# EAGLE design IA-prop-raspberry (EAGLE 6.1)
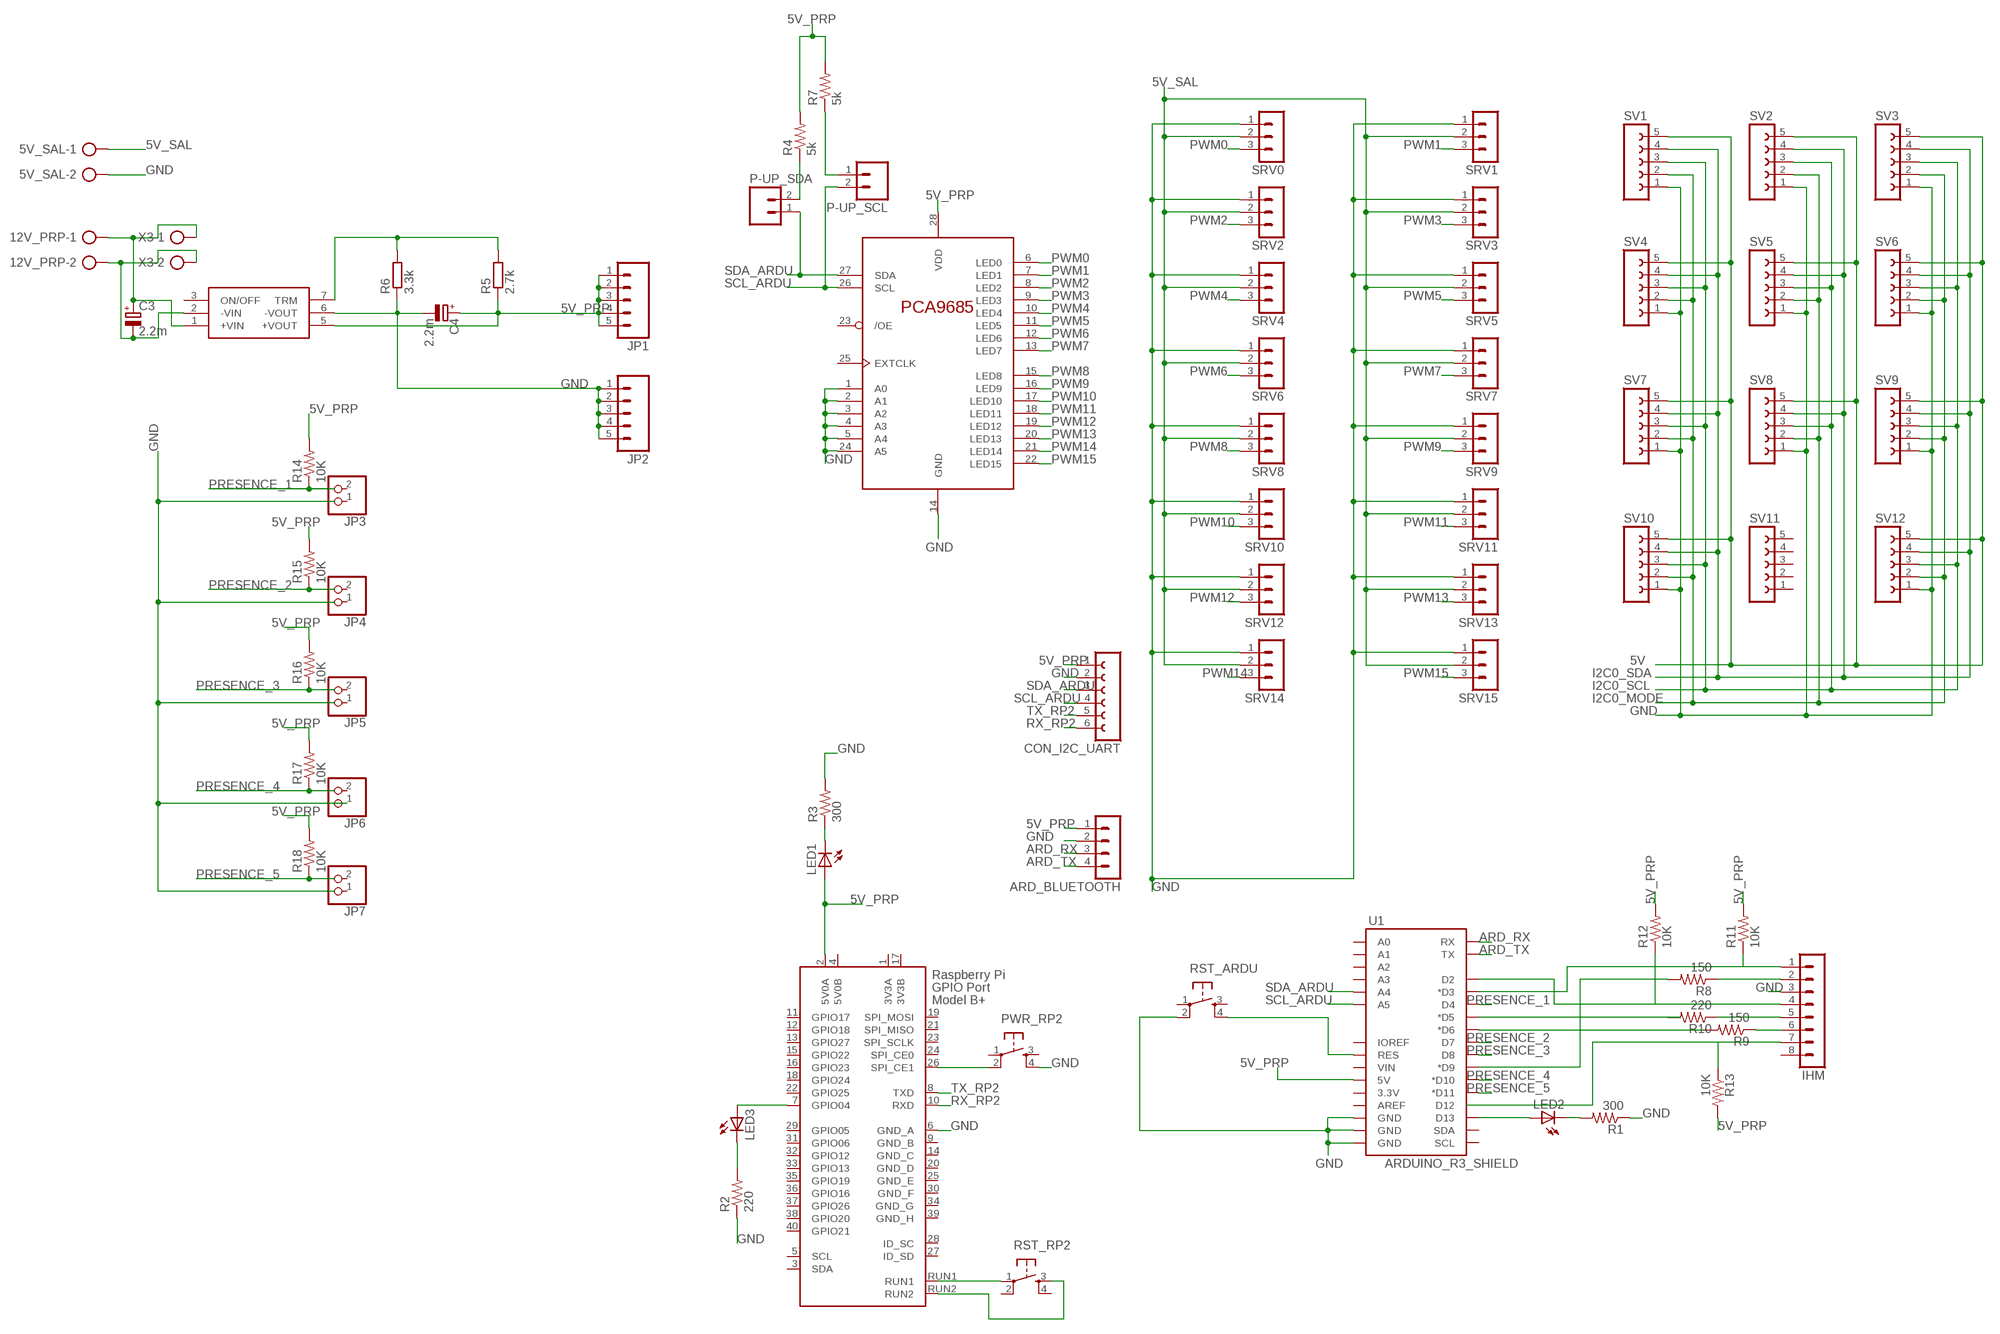
[diagram p0: schematic, sheet 1]

## Parts
5V_SAL  AK300/2  [AK300/2]
12V_PRP  AK300/2  [AK300/2]
ARD_BLUETOOTH  MA04-1  [MA04-1]
C3  2.2m  CPOL-EUE5-13  [E5-13]
C4  2.2m  CPOL-EUE5-13  [E5-13]
CON_I2C_UART  FE06-1  [FE06]
IHM  MA08-1  [MA08-1]
JP1  M05PTH  [1X05]
JP2  M05PTH  [1X05]
JP3  PINHD-1X2  [1X02]
JP4  PINHD-1X2  [1X02]
JP5  PINHD-1X2  [1X02]
JP6  PINHD-1X2  [1X02]
JP7  PINHD-1X2  [1X02]
LED1  LED3MM  [LED3MM]
LED2  LED3MM  [LED3MM]
LED3  LED3MM  [LED3MM]
P-UP_SCL  M02PTH  [1X02]
P-UP_SDA  M02PTH  [1X02]
PWR_RP2  TAC_SWITCHPTH  [TACTILE-PTH]
R1  300  RESISTORAXIAL-0.3  [AXIAL-0.3]
R2  220  RESISTORAXIAL-0.3  [AXIAL-0.3]
R3  300  RESISTORAXIAL-0.3  [AXIAL-0.3]
R4  5k  RESISTORAXIAL-0.3  [AXIAL-0.3]
R5  2.7k  R-EU_0207/7  [0207/7]
R6  3.3k  R-EU_0207/7  [0207/7]
R7  5k  RESISTORAXIAL-0.3  [AXIAL-0.3]
R8  150  RESISTORAXIAL-0.3  [AXIAL-0.3]
R9  150  RESISTORAXIAL-0.3  [AXIAL-0.3]
R10  220  RESISTORAXIAL-0.3  [AXIAL-0.3]
R11  10K  RESISTORAXIAL-0.3  [AXIAL-0.3]
R12  10K  RESISTORAXIAL-0.3  [AXIAL-0.3]
R13  10K  RESISTORAXIAL-0.3  [AXIAL-0.3]
R14  10K  RESISTORAXIAL-0.3  [AXIAL-0.3]
R15  10K  RESISTORAXIAL-0.3  [AXIAL-0.3]
R16  10K  RESISTORAXIAL-0.3  [AXIAL-0.3]
R17  10K  RESISTORAXIAL-0.3  [AXIAL-0.3]
R18  10K  RESISTORAXIAL-0.3  [AXIAL-0.3]
RP2  RASPI_BOARD_B+#_FP  [RASPI_BOARD_B+_FULL_PAD]
RST_ARDU  TAC_SWITCHPTH  [TACTILE-PTH]
RST_RP2  TAC_SWITCHPTH  [TACTILE-PTH]
SRV0  MA03-1  [MA03-1]
SRV1  MA03-1  [MA03-1]
SRV2  MA03-1  [MA03-1]
SRV3  MA03-1  [MA03-1]
SRV4  MA03-1  [MA03-1]
SRV5  MA03-1  [MA03-1]
SRV6  MA03-1  [MA03-1]
SRV7  MA03-1  [MA03-1]
SRV8  MA03-1  [MA03-1]
SRV9  MA03-1  [MA03-1]
SRV10  MA03-1  [MA03-1]
SRV11  MA03-1  [MA03-1]
SRV12  MA03-1  [MA03-1]
SRV13  MA03-1  [MA03-1]
SRV14  MA03-1  [MA03-1]
SRV15  MA03-1  [MA03-1]
SV1  FE05-1  [FE05-1]
SV2  FE05-1  [FE05-1]
SV3  FE05-1  [FE05-1]
SV4  FE05-1  [FE05-1]
SV5  FE05-1  [FE05-1]
SV6  FE05-1  [FE05-1]
SV7  FE05-1  [FE05-1]
SV8  FE05-1  [FE05-1]
SV9  FE05-1  [FE05-1]
SV10  FE05-1  [FE05-1]
SV11  FE05-1  [FE05-1]
SV12  FE05-1  [FE05-1]
U1  ARDUINO_R3_SHIELD  [UNO_R3_SHIELD]
U$1  PCA9685PW  [TSSOP28]
U$2  TEN25-1211TEN25-1211  [TEN25]
X3  AK300/2  [AK300/2]

## Nets
5V: SV1.5 SV2.5 SV3.5 SV4.5 SV5.5 SV6.5 SV7.5 SV8.5 SV9.5 SV10.5 SV12.5
5V_PRP: ARD_BLUETOOTH.1 C4.+ CON_I2C_UART.1 JP1.1 JP1.2 JP1.3 JP1.4 JP1.5 LED1.A R4.P$2 R5.1 R7.P$2 R11.P$2 R12.P$2 R13.P$2 R14.P$2 R15.P$2 R16.P$2 R17.P$2 R18.P$2 RP2.2(5V0A) U1.5V U$1.28(VDD) U$2.5(+VOUT)
5V_PRP1: LED2.A U1.D13
5V_SAL: 5V_SAL.1 SRV0.2 SRV1.2 SRV2.2 SRV3.2 SRV4.2 SRV5.2 SRV6.2 SRV7.2 SRV8.2 SRV9.2 SRV10.2 SRV11.2 SRV12.2 SRV13.2 SRV14.2 SRV15.2
+12V: 12V_PRP.1 C3.+ U$2.1(+VIN) X3.1
ARD_RX: ARD_BLUETOOTH.3 U1.RX
ARD_TX: ARD_BLUETOOTH.4 U1.TX
GND: 5V_SAL.2 ARD_BLUETOOTH.2 C4.- CON_I2C_UART.2 IHM.3 JP2.1 JP2.2 JP2.3 JP2.4 JP2.5 JP6.1 PWR_RP2.4 R1.P$1 R2.P$1 R3.P$2 R6.1 RP2.6(GND_A) RST_ARDU.2 SRV0.1 SRV1.1 SRV2.1 SRV3.1 SRV4.1 SRV5.1 SRV6.1 SRV7.1 SRV8.1 SRV9.1 SRV10.1 SRV11.1 SRV12.1 SRV13.1 SRV14.1 SRV15.1 SV1.1 SV2.1 SV3.1 SV4.1 SV5.1 SV6.1 SV7.1 SV8.1 SV9.1 SV10.1 SV12.1 U1.GND@0(GND) U1.GND@1(GND) U1.GND@2(GND) U$1.1(A0) U$1.2(A1) U$1.3(A2) U$1.4(A3) U$1.5(A4) U$1.14(GND) U$1.24(A5) U$2.6(-VOUT)
GND_12: 12V_PRP.2 C3.- U$2.2(-VIN) X3.2
I2C0_MODE: SV1.2 SV2.2 SV3.2 SV4.2 SV5.2 SV6.2 SV7.2 SV8.2 SV9.2 SV10.2 SV12.2
I2C0_SCL: SV1.3 SV2.3 SV3.3 SV4.3 SV5.3 SV6.3 SV7.3 SV8.3 SV9.3 SV10.3 SV12.3
I2C0_SDA: SV1.4 SV2.4 SV3.4 SV4.4 SV5.4 SV6.4 SV7.4 SV8.4 SV9.4 SV10.4 SV12.4
N$1: RP2.RUN2 RST_RP2.3
N$2: LED2.K(C) R1.P$2
N$3: LED3.K(C) R2.P$2
N$4: R5.2 R6.2 U$2.7(TRM)
N$5: P-UP_SDA.2 R4.P$1
N$7: LED1.K(C) R3.P$1
N$8: RST_ARDU.4 U1.RES
N$9: P-UP_SCL.1 R7.P$1
N$39: U1.D5(*D5)
N$40: R9.P$2 U1.D6(*D6)
N$41: IHM.6 R9.P$1
N$42: LED3.A RP2.7(GPIO04)
N$43: IHM.5 R10.P$1
N$44: IHM.2 R8.P$1
N$45: R8.P$2 U1.D9(*D9)
N$46: IHM.1 R11.P$1 U1.D3(*D3)
N$47: IHM.4 R12.P$1 U1.D2
N$48: RP2.RUN1 RST_RP2.1
N$49: IHM.7 R13.P$1
PRESENCE_1: R14.P$1 U1.D4
PRESENCE_2: R15.P$1 U1.D7
PRESENCE_3: R16.P$1 U1.D8
PRESENCE_4: R17.P$1 U1.D10(*D10)
PRESENCE_5: R18.P$1 U1.D11(*D11)
PWM0: SRV0.3 U$1.6(LED0)
PWM1: SRV1.3 U$1.7(LED1)
PWM2: SRV2.3 U$1.8(LED2)
PWM3: SRV3.3 U$1.9(LED3)
PWM4: SRV4.3 U$1.10(LED4)
PWM5: SRV5.3 U$1.11(LED5)
PWM6: SRV6.3 U$1.12(LED6)
PWM7: SRV7.3 U$1.13(LED7)
PWM8: SRV8.3 U$1.15(LED8)
PWM9: SRV9.3 U$1.16(LED9)
PWM10: SRV10.3 U$1.17(LED10)
PWM11: SRV11.3 U$1.18(LED11)
PWM12: SRV12.3 U$1.19(LED12)
PWM13: SRV13.3 U$1.20(LED13)
PWM14: SRV14.3 U$1.21(LED14)
PWM15: SRV15.3 U$1.22(LED15)
RP2_PWR: PWR_RP2.2 RP2.26(SPI_CE1)
RX_RP2: CON_I2C_UART.6 RP2.10(RXD)
SCL_ARDU: CON_I2C_UART.4 P-UP_SCL.2 U1.A5 U$1.26(SCL)
SDA_ARDU: CON_I2C_UART.3 P-UP_SDA.1 U1.A4 U$1.27(SDA)
TX_RP2: CON_I2C_UART.5 RP2.8(TXD)
Unconnected: IHM.8 JP3.1 JP3.2 JP4.1 JP4.2 JP5.1 JP5.2 JP6.2 JP7.1 JP7.2 PWR_RP2.1 PWR_RP2.3 R10.P$2 RP2.3(SDA) RP2.5(SCL) RP2.11(GPIO17) RP2.12(GPIO18) RP2.13(GPIO27) RP2.15(GPIO22) RP2.16(GPIO23) RP2.18(GPIO24) RP2.19(SPI_MOSI) RP2.21(SPI_MISO) RP2.22(GPIO25) RP2.23(SPI_SCLK) RP2.24(SPI_CE0) RP2.27(ID_SD) RP2.28(ID_SC) RP2.29(GPIO05) RP2.31(GPIO06) RP2.32(GPIO12) RP2.33(GPIO13) RP2.35(GPIO19) RP2.36(GPIO16) RP2.37(GPIO26) RP2.38(GPIO20) RP2.40(GPIO21) RST_ARDU.1 RST_ARDU.3 RST_RP2.2 RST_RP2.4 SV11.1 SV11.2 SV11.3 SV11.4 SV11.5 U1.3.3V U1.A0 U1.A1 U1.A2 U1.A3 U1.AREF U1.D12 U1.IOREF U1.SCL U1.SDA U1.VIN U$1.23(/OE) U$1.25(EXTCLK) U$2.3(ON/OFF)

## Power pins joined to a net without a drawn wire
3V3A: RP2.1(3V3A)
3V3B: RP2.17(3V3B)
5V0B: RP2.4(5V0B)
GND_B: RP2.9(GND_B)
GND_C: RP2.14(GND_C)
GND_D: RP2.20(GND_D)
GND_E: RP2.25(GND_E)
GND_F: RP2.30(GND_F)
GND_G: RP2.34(GND_G)
GND_H: RP2.39(GND_H)

## Library data of the parts
5V_SAL 12V_PRP X3 = con-ptr500:AK300/2: CONNECTOR; OC_FARNELL: unknown; OC_NEWARK: unknown
ARD_BLUETOOTH = con-lstb:MA04-1: PIN HEADER
C3 C4 = resistor:CPOL-EU: POLARIZED CAPACITOR, European symbol
CON_I2C_UART = con-lsta:FE06-1: FEMALE HEADER; OC_FARNELL: unknown; OC_NEWARK: unknown
IHM = con-lstb:MA08-1: PIN HEADER
JP1 JP2 = SparkFun:M05: Header 5 Standard 5-pin 0.1" header. Use with straight break away headers (SKU : PRT-00116), right angle break away headers (PRT-00553), swiss pins (PRT-00743), machine pins (PRT-00117), and female headers (PRT-00115). Molex polarized connector foot print use with SKU : PRT-08230 with associated crimp pins and housings.
JP3-JP7 = pinhead:PINHD-1X2: PIN HEADER
LED1-LED3 = SparkFun:LED: LEDs Standard schematic elements and footprints for 5mm, 3mm, 1206, and 0603 sized LEDs. 5mm - Spark Fun Electronics SKU : COM-00529 (and others)
P-UP_SCL P-UP_SDA = SparkFun:M02: Header 2 Standard 2-pin 0.1" header. Use with straight break away headers (SKU : PRT-00116), right angle break away headers (PRT-00553), swiss pins (PRT-00743), machine pins (PRT-00117), and female headers (PRT-00115). Molex polarized connector foot print use with SKU : PRT-08233 with associated crimp pins and housings.
PWR_RP2 RST_ARDU RST_RP2 = SparkFun:TAC_SWITCH: Momentary Switch Button commonly used for reset or general input. Spark Fun Electronics SKU : COM-00097
R1-R4 R7-R18 = SparkFun:RESISTOR: Resistor Basic schematic elements and footprints for 0603, 1206, and PTH resistors.
R5 R6 = resistor:R-EU_: RESISTOR, European symbol
RP2 = raspberrypi_bastelstube_v13-enac:RASPI_BOARD_B+#: Raspberry Pi GPIO connector with markings for the outer dimensions of the Raspberry Pi board model B+ with different sets of drill holes or mounting pads All pins connected
SRV0 SRV1-SRV15 = con-lstb:MA03-1: PIN HEADER
SV1-SV12 = con-lsta:FE05-1: FEMALE HEADER; OC_FARNELL: unknown; OC_NEWARK: unknown
U1 = SparkFun-Boards:ARDUINO_R3_SHIELD: Shield form compatible with the Arduino Uno R3.
U$1 = PCA9685:PCA9685
U$2 = tracopower:TEN25-1211

## Board
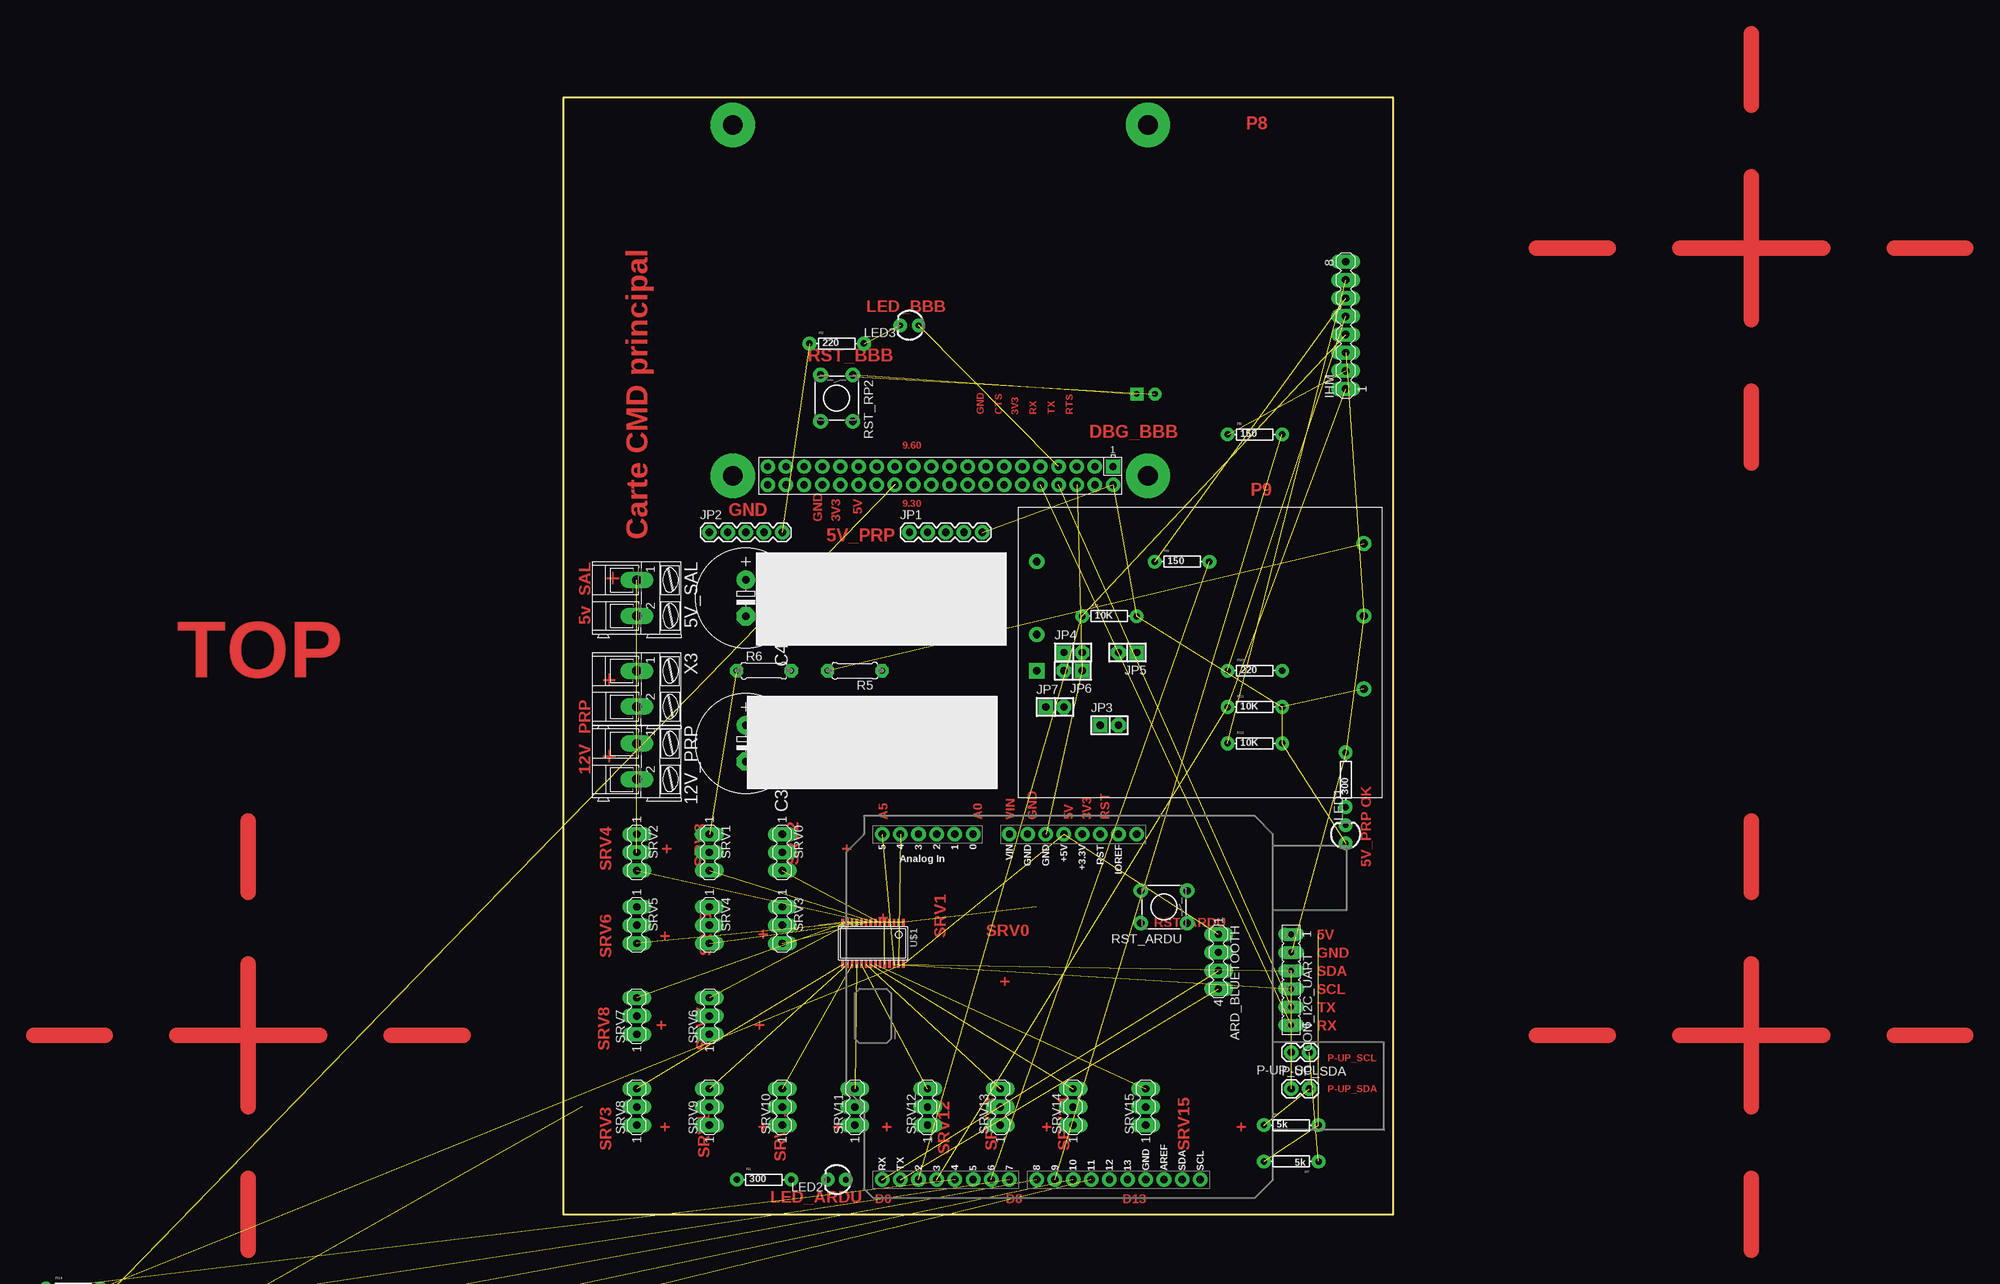
[diagram p1: board, top side]
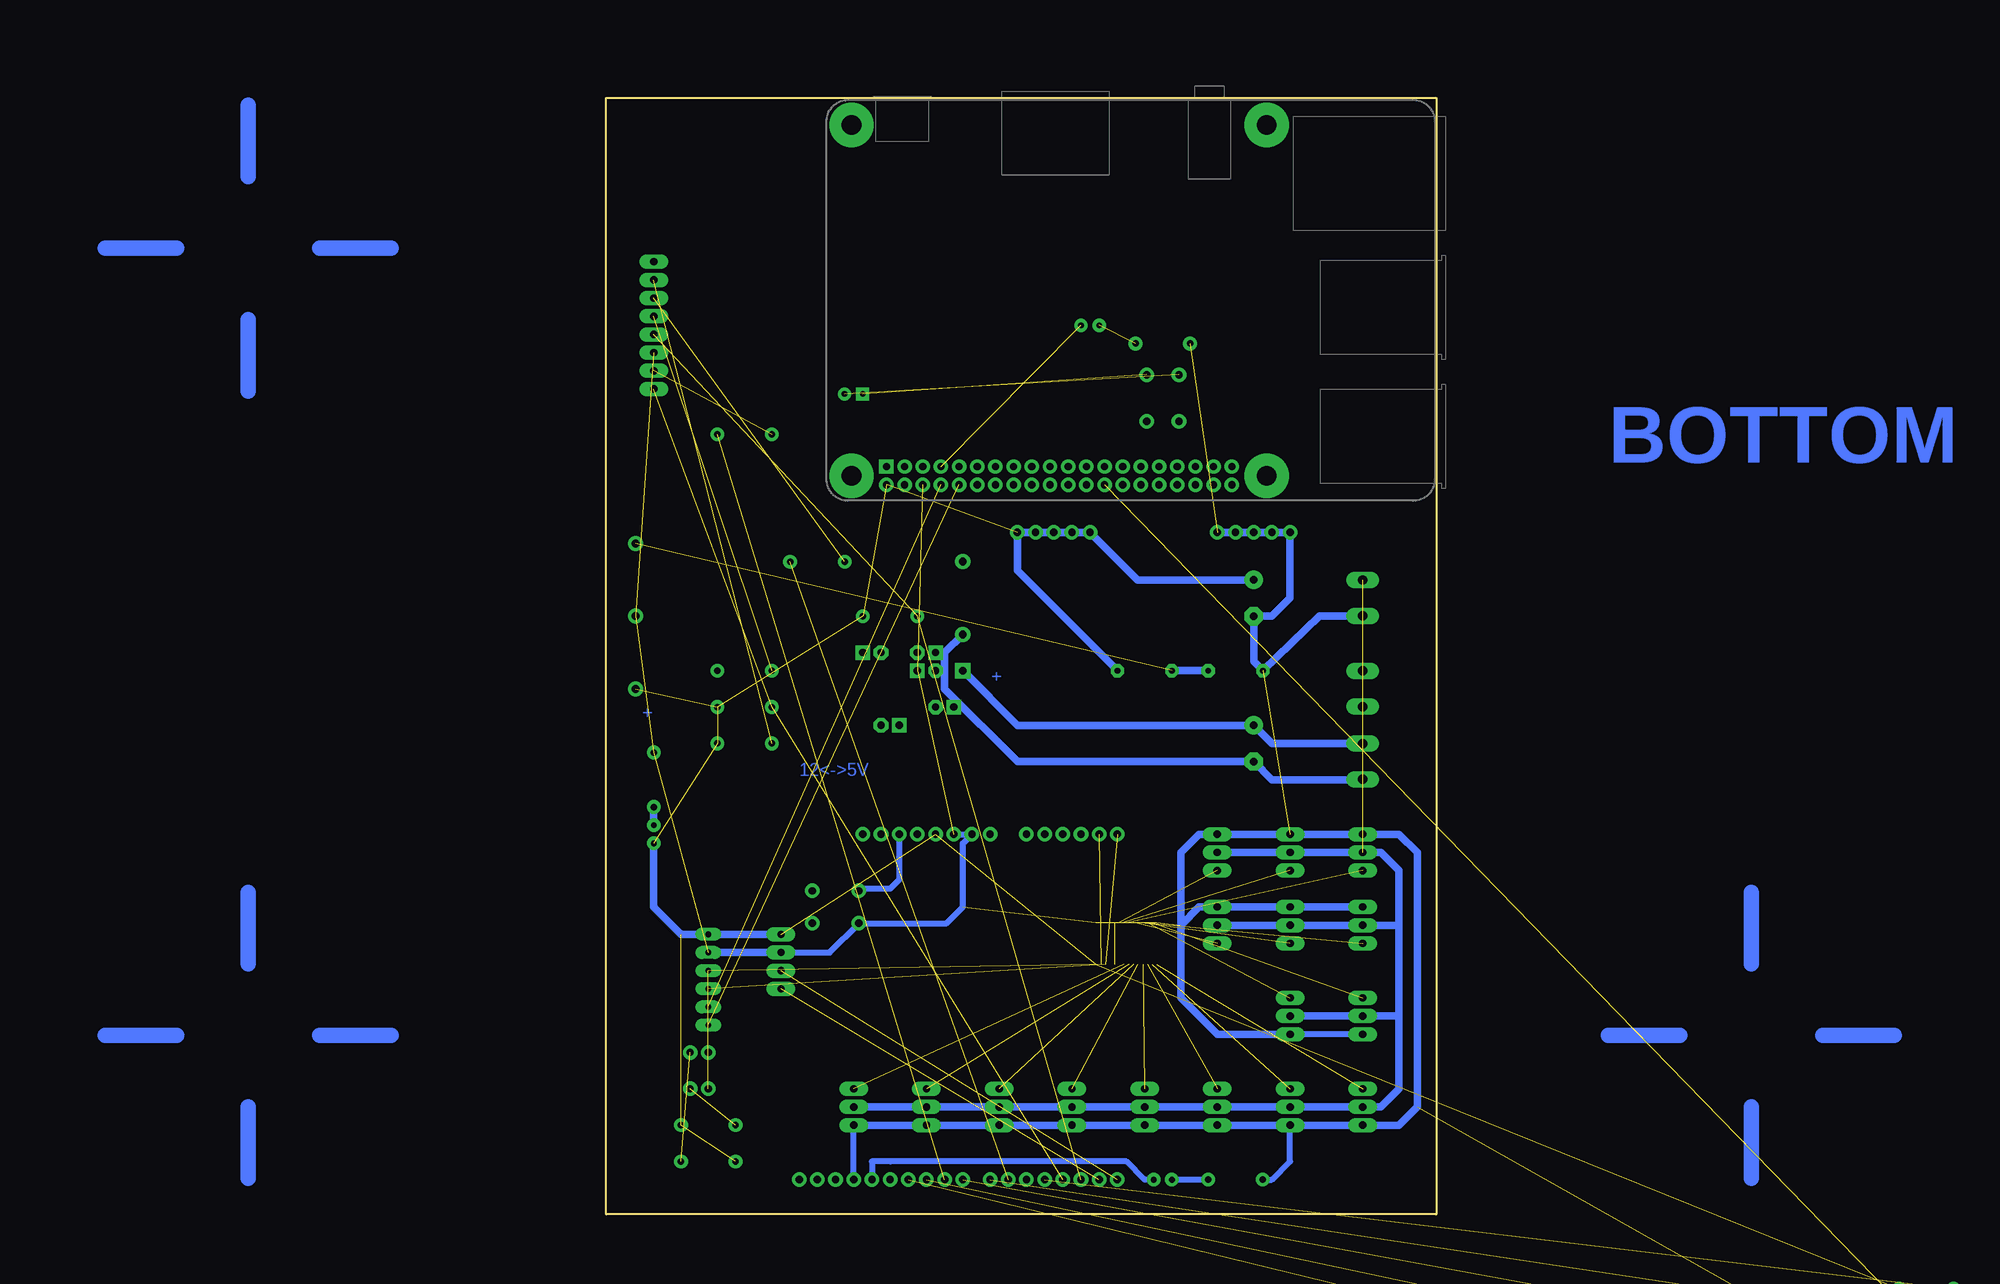
[diagram p2: board, bottom side, seen from below]

Size 116 x 156 mm. Coordinates in mm from the lower left corner, seen from the top.
Outline: 0,0 116,0 116,156 0,156 0,0
Copper layers (1*16): Top 0.035mm / dielectric 1.5mm / Bottom 0.035mm
Design rules: minimum track width 10mil, minimum drill 10mil, track to track 15mil, track to pad 15mil, pad to pad 15mil, via to via 15mil, smd to smd 8mil, copper to edge 40mil, drill to drill 8mil, minimum pad ring 15mil, minimum via ring 8mil, stop-mask expansion 4mil, vias tented up to drill 0mil, thermal gap 10mil

### Footprints (pad centres in the part's own frame; a part is rotated, then mirrored left to right if it is on the bottom)
AK300/2 = drill 1.321 long: 1 -2.515,0; 2 2.489,0
MA04-1 = drill 1.016 long: 1 -3.81,0; 2 -1.27,0; 3 1.27,0; 4 3.81,0
E5-13 = drill 1.016 pad 2.54: + -2.54,0 | drill 1.016 pad 2.54 octagon: - 2.54,0
FE06 = drill 0.813 long: 1 -6.35,0; 2 -3.81,0; 3 -1.27,0; 4 1.27,0; 5 3.81,0; 6 6.35,0
MA08-1 = drill 1.016 long: 1 -8.89,0; 2 -6.35,0; 3 -3.81,0; 4 -1.27,0; 5 1.27,0; 6 3.81,0; 7 6.35,0; 8 8.89,0
1X05 = drill 1.016 pad 1.88: 1 0,0; 2 2.54,0; 3 5.08,0; 4 7.62,0; 5 10.16,0
1X02 = drill 1.016 square: 1 -1.27,0 | drill 1.016 octagon: 2 1.27,0
LED3MM = drill 0.813 pad 1.88: A -1.27,0; K 1.27,0
1X02' = drill 1.016 pad 1.88: 1 0,0; 2 2.54,0
TACTILE-PTH = drill 1.016 pad 1.88: 1 -3.251,2.261; 2 3.251,2.261; 3 -3.251,-2.261; 4 3.251,-2.261
AXIAL-0.3 = drill 0.9 pad 1.88: P$1 -3.81,0; P$2 3.81,0
0207/7 = drill 0.813 octagon: 1 -3.81,0; 2 3.81,0
RASPI_BOARD_B+_FULL_PAD = drill 1 pad 1.778 square: 1 8.37,51.23 | drill 1 pad 1.778: 2 8.37,53.77; 3 10.91,51.23; 4 10.91,53.77; 5 13.45,51.23; 6 13.45,53.77; 7 15.99,51.23; 8 15.99,53.77; 9 18.53,51.23; 10 18.53,53.77; 11 21.07,51.23; 12 21.07,53.77; 13 23.61,51.23; 14 23.61,53.77; 15 26.15,51.23; 16 26.15,53.77; 17 28.69,51.23; 18 28.69,53.77; 19 31.23,51.23; 20 31.23,53.77; 21 33.77,51.23; 22 33.77,53.77; 23 36.31,51.23; 24 36.31,53.77; 25 38.85,51.23; 26 38.85,53.77; 27 41.39,51.23; 28 41.39,53.77; 29 43.93,51.23; 30 43.93,53.77; 31 46.47,51.23; 32 46.47,53.77; 33 49.01,51.23; 34 49.01,53.77; 35 51.55,51.23; 36 51.55,53.77; 37 54.09,51.23; 38 54.09,53.77; 39 56.63,51.23; 40 56.63,53.77 | drill 2.75 pad 6.2: DRILL_1 3.5,52.5; DRILL_2 61.5,52.5; DRILL_3 3.5,3.5; DRILL_4 61.5,3.5 | drill 0.8 square: RUN1 5.068,41.07 | drill 0.8: RUN2 2.528,41.07
MA03-1 = drill 1.016 long: 1 -2.54,0; 2 0,0; 3 2.54,0
FE05-1 = drill 0.813 long: 1 -5.08,0; 2 -2.54,0; 3 0,0; 4 2.54,0; 5 5.08,0
UNO_R3_SHIELD = drill 1.016 pad 1.88: 3.3V 50.8,26.67; 5V 50.8,29.21; A0 50.8,41.91; A1 50.8,44.45; A2 50.8,46.99; A3 50.8,49.53; A4 50.8,52.07; A5 50.8,54.61; AREF 2.54,15.24; D2 2.54,49.53; D3 2.54,46.99; D4 2.54,44.45; D5 2.54,41.91; D6 2.54,39.37; D7 2.54,36.83; D8 2.54,33.02; D9 2.54,30.48; D10 2.54,27.94; D11 2.54,25.4; D12 2.54,22.86; D13 2.54,20.32; GND@0 50.8,31.75; GND@1 50.8,34.29; GND@2 2.54,17.78; IOREF 50.8,21.59; NC 50.8,19.05; RES 50.8,24.13; RX 2.54,54.61; SCL 2.54,10.16; SDA 2.54,12.7; TX 2.54,52.07; VIN 50.8,36.83
TSSOP28 = smd 0.305 x 0.991: 1 -4.225,-2.918; 2 -3.575,-2.918; 3 -2.925,-2.918; 4 -2.275,-2.918; 5 -1.625,-2.918; 6 -0.975,-2.918; 7 -0.325,-2.918; 8 0.325,-2.918; 9 0.975,-2.918; 10 1.625,-2.918; 11 2.275,-2.918; 12 2.925,-2.918; 13 3.575,-2.918; 14 4.225,-2.918; 15 4.225,2.918; 16 3.575,2.918; 17 2.925,2.918; 18 2.275,2.918; 19 1.625,2.918; 20 0.975,2.918; 21 0.325,2.918; 22 -0.325,2.918; 23 -0.975,2.918; 24 -1.625,2.918; 25 -2.275,2.918; 26 -2.925,2.918; 27 -3.575,2.918; 28 -4.225,2.918
TEN25 = drill 1.1 pad 1.778 square: 1 0,0 | drill 1.1 pad 1.778: 2 0,5.08; 3 0,15.24; 5 45.72,-2.54; 6 45.72,7.62; 7 45.72,17.78

### Placement (x,y rotation side)
5V_SAL  10.28,86.12 270 top
12V_PRP  10.28,63.26 270 top
ARD_BLUETOOTH  91.56,35.32 270 top
C3  25.52,65.8 270 top
C4  25.52,86.12 270 top
CON_I2C_UART  101.72,32.78 270 top
IHM  109.34,124.22 90 top
JP1  48.38,95.3 0 top
JP2  20.44,95.3 0 top
JP3  76.32,68.34 0 top
JP4  71.24,78.5 0 top
JP5  78.86,78.5 180 top
JP6  71.24,75.96 180 top
JP7  68.7,70.88 0 top
LED1  109.34,53.1 90 top
LED2  38.22,4.84 180 top
LED3  48.38,124.22 180 top
P-UP_SCL  [1X02']  104.26,22.62 180 top
P-UP_SDA  [1X02']  101.72,17.54 0 top
PWR_RP2  -81.16,-28.18 0 top  (outside the outline)
R1  28.06,4.84 0 top
R2  38.22,121.68 0 top
R3  109.34,60.72 90 top
R4  101.72,12.46 0 top
R5  40.76,75.96 180 top
R6  28.06,75.96 0 top
R7  101.72,7.38 180 top
R8  96.64,108.98 0 top
R9  86.48,91.2 0 top
R10  96.64,75.96 0 top
R11  96.64,70.88 0 top
R12  76.32,83.58 0 top
R13  96.64,65.8 0 top
R14  -68.46,-10.4 0 top  (outside the outline)
R15  -68.46,-15.48 0 top  (outside the outline)
R16  -68.46,-20.56 0 top  (outside the outline)
R17  -68.46,-25.64 0 top  (outside the outline)
R18  -68.46,-30.72 0 top  (outside the outline)
RP2  85.21,155.72 180 top
RST_ARDU  83.94,42.94 180 top
RST_RP2  38.22,114.06 270 top
SRV0  30.6,50.56 270 top
SRV1  20.44,50.56 270 top
SRV2  10.28,50.56 270 top
SRV3  30.6,40.4 270 top
SRV4  20.44,40.4 270 top
SRV5  10.28,40.4 270 top
SRV6  20.44,27.7 90 top
SRV7  10.28,27.7 90 top
SRV8  10.28,15 90 top
SRV9  20.44,15 90 top
SRV10  30.6,15 90 top
SRV11  40.76,15 90 top
SRV12  50.92,15 90 top
SRV13  61.08,15 90 top
SRV14  71.24,15 90 top
SRV15  81.4,15 90 top
SV1  -76.08,-35.8 0 top  (outside the outline)
SV2  -76.08,-43.42 0 top  (outside the outline)
SV3  -76.08,-51.04 0 top  (outside the outline)
SV4  -76.08,-58.66 0 top  (outside the outline)
SV5  -76.08,-66.28 0 top  (outside the outline)
SV6  -76.08,-73.9 0 top  (outside the outline)
SV7  -76.08,-81.52 0 top  (outside the outline)
SV8  -76.08,-89.14 0 top  (outside the outline)
SV9  -76.08,-96.76 0 top  (outside the outline)
SV10  -76.08,-104.38 0 top  (outside the outline)
SV11  -76.08,-112 0 top  (outside the outline)
SV12  -76.08,-119.62 0 top  (outside the outline)
U1  99.18,2.3 90 top
U$1  43.3,37.86 180 top
U$2  66.16,75.96 0 top
X3  10.28,73.42 270 top

### Tracks (layer width: path | path; a pad name or v marks a point on that pad's centre or on a via)
5V  (10 unrouted)
5V_PRP  (15 unrouted)
  Bottom 1.016: ARD_BLUETOOTH.1 CON_I2C_UART.1 105.53,39.13 109.34,42.94 LED1.A | R5.1 58.54,89.93 JP1.5 JP1.4 JP1.3 JP1.2 JP1.1 41.74,88.66 C4.+
5V_PRP1
  Bottom 0.813: LED2.A 40.76,4.84 43.3,7.38 76.32,7.38 78.86,7.38 U1.D13
5V_SAL  (1 unrouted)
  Bottom 1.016: SRV15.2 SRV14.2 SRV13.2 SRV12.2 SRV11.2 SRV10.2 SRV9.2 SRV8.2 7.74,15 5.2,17.54 5.2,27.7 | SRV3.2 SRV4.2 SRV5.2 5.2,40.4 | SRV0.2 SRV1.2 SRV2.2 7.74,50.56 5.2,48.02 5.2,40.4 | SRV6.2 SRV7.2 5.2,27.7 | 5.2,27.7 5.2,40.4
+12V  (2 unrouted)
  Bottom 1.016: U$2.1 58.54,68.34 C3.+ 22.98,65.8 10.28,65.8
ARD_RX  (1 unrouted)
ARD_TX  (1 unrouted)
GND  (27 unrouted)
  Bottom 0.813: R1.P$1 22.98,4.84 20.44,7.38 SRV9.1 | U1.GND@2 SRV15.1 | SRV7.1 SRV6.1 | 33.14,42.94 SRV3.1 | ARD_BLUETOOTH.2 84.78,36.59 RST_ARDU.2 68.42,40.68 66.16,42.94 66.16,51.83 U1.GND@1 U1.GND@0
  Bottom 1.016: SRV15.1 SRV14.1 SRV13.1 SRV12.1 SRV11.1 SRV10.1 SRV9.1 SRV8.1 5.2,12.46 2.66,15 2.66,50.56 5.2,53.1 SRV2.1 SRV1.1 SRV0.1 33.14,53.1 35.68,50.56 35.68,40.4 | SRV6.1 30.6,25.16 35.68,30.24 35.68,40.4 | 35.68,40.4 33.14,42.94 SRV3.1 SRV4.1 SRV5.1 | ARD_BLUETOOTH.2 CON_I2C_UART.2 | 5V_SAL.2 16.33,83.63 R6.1 25.52,77.23 C4.- 22.98,83.58 20.44,86.12 JP2.1 JP2.2 JP2.3 JP2.4 JP2.5
GND_12  (2 unrouted)
  Bottom 1.016: 10.28,60.72 22.98,60.72 C3.- 58.54,63.26 68.7,73.42 68.7,78.5 U$2.2
I2C0_MODE  (10 unrouted)
I2C0_SCL  (10 unrouted)
I2C0_SDA  (10 unrouted)
N$1  (1 unrouted)
N$2
  Bottom 0.813: R1.P$2 LED2.K
N$3  (1 unrouted)
N$4  (1 unrouted)
  Bottom 1.016: R5.2 R6.2
N$5  (1 unrouted)
N$6
  Top 2.184: -74,25 -64,25
N$7
  Bottom 1.016: LED1.K R3.P$1
N$8
  Bottom 0.813: U1.RES 75.05,46.75 76.32,45.48 80.41,45.48 RST_ARDU.4
N$9  (1 unrouted)
N$10
  Top 2.184: -54,25 -34,25
N$11
  Top 2.184: -24,25 -14,25
N$12
  Top 2.184: -44,35 -44,15
N$13
  Top 2.184: -44,45 -44,55
N$14
  Top 2.184: -44,5 -44,-5
N$15
  Bottom 2.184: -44,45 -44,35
N$16
  Bottom 2.184: -64,25 -54,25
N$17
  Bottom 2.184: -34,25 -24,25
N$18
  Bottom 2.184: -44,15 -44,5
N$19
  Top 2.184: 136,25 146,25
N$20
  Top 2.184: 156,25 176,25
N$21
  Top 2.184: 186,25 196,25
N$22
  Top 2.184: 166,35 166,15
N$23
  Top 2.184: 166,45 166,55
N$24
  Top 2.184: 166,5 166,-5
N$25
  Bottom 2.184: 166,45 166,35
N$26
  Bottom 2.184: 146,25 156,25
N$27
  Bottom 2.184: 176,25 186,25
N$28
  Bottom 2.184: 166,15 166,5
N$29
  Top 2.184: 136,135 146,135
N$30
  Top 2.184: 156,135 176,135
N$31
  Top 2.184: 186,135 196,135
N$32
  Top 2.184: 166,145 166,125
N$33
  Top 2.184: 166,155 166,165
N$34
  Top 2.184: 166,115 166,105
N$35
  Bottom 2.184: 166,155 166,145
N$36
  Bottom 2.184: 146,135 156,135
N$37
  Bottom 2.184: 176,135 186,135
N$38
  Bottom 2.184: 166,125 166,115
N$40  (1 unrouted)
N$41  (1 unrouted)
N$42  (1 unrouted)
N$43  (1 unrouted)
N$44  (1 unrouted)
N$45  (1 unrouted)
N$46  (2 unrouted)
N$47  (2 unrouted)
N$48  (1 unrouted)
N$49  (1 unrouted)
PRESENCE_1  (1 unrouted)
PRESENCE_2  (1 unrouted)
PRESENCE_3  (1 unrouted)
PRESENCE_4  (1 unrouted)
PRESENCE_5  (1 unrouted)
PWM0  (1 unrouted)
PWM1  (1 unrouted)
PWM2  (1 unrouted)
PWM3  (1 unrouted)
PWM4  (1 unrouted)
PWM5  (1 unrouted)
PWM6  (1 unrouted)
PWM7  (1 unrouted)
PWM8  (1 unrouted)
PWM9  (1 unrouted)
PWM10  (1 unrouted)
PWM11  (1 unrouted)
PWM12  (1 unrouted)
PWM13  (1 unrouted)
PWM14  (1 unrouted)
PWM15  (1 unrouted)
RP2_PWR  (1 unrouted)
RX_RP2  (1 unrouted)
SCL_ARDU  (3 unrouted)
SDA_ARDU  (3 unrouted)
TX_RP2  (1 unrouted)

### Text on the board
Top: P8 | LED_BBB | RST_BBB | GND | CTS | 3V3 | RX | TX | RTS | DBG_BBB | 9.60 | P9 | GND | 9.30 | 5V | GND | 3V3 | 5V_PRP | Carte CMD principal | 5v_SAL | + | TOP | + | 12V_PRP | + | A5 | A0 | VIN | GND | 5V | 3V3 | RST | + | + | + | SRV3 | SRV2 | 5V_PRP OK | SRV4 | + | RST_ARDU | SRV1 | SRV0 | + | + | 5V | SRV6 | SRV5 | GND | SDA | + | SCL | TX | + | + | RX | SRV8 | SRV7 | P-UP_SCL | P-UP_SDA | + | + | + | + | + | + | + | SRV3 | SRV13 | SRV14 | SRV15 | SRV10 | SRV12 | SRV11 | LED_ARDU | D0 | D8 | D13
Bottom: BOTTOM | + | + | 12<->5V